# EAGLE schematic ftdiemu (EAGLE 7.2.0)
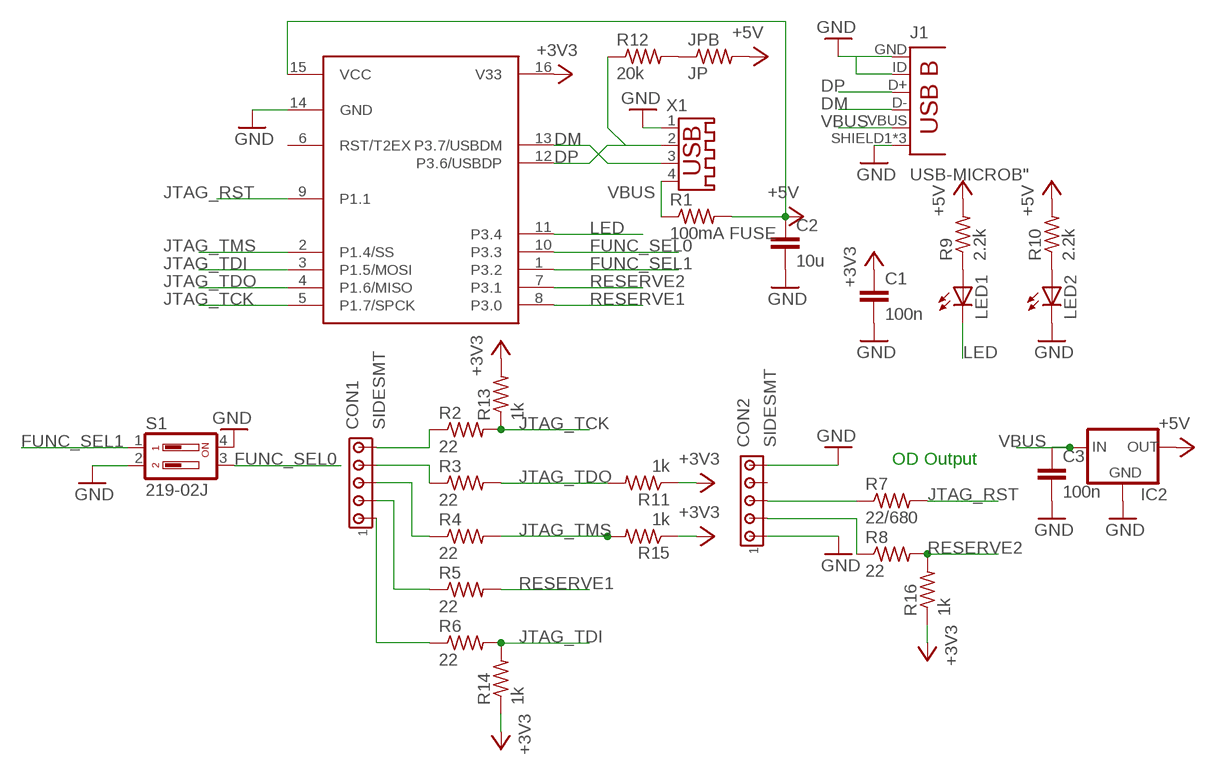
[diagram p0: schematic, sheet 1]

## Parts
C1  100n  C-EUC0805  [C0805]
C2  10u  C-EUC0805  [C0805]
C3  100n  C-EUC0805  [C0805]
CON1  SIDESMT  [SIDESMT]
CON2  SIDESMT  [SIDESMT]
IC1  CH551G-16L  [SO-16]
IC2  XC63FPM  [SOT23]
J1  USB-MICROB"  [USB-B-MICRO-SMD_V03]
JPB  JP  R-US_R0201  [R0201]
LED1  LEDSML0805  [SML0805]
LED2  LEDSML0805  [SML0805]
R1  100mA FUSE  R-US_M0805  [M0805]
R2  22  R-US_R0402  [R0402]
R3  22  R-US_R0402  [R0402]
R4  22  R-US_R0402  [R0402]
R5  22  R-US_R0402  [R0402]
R6  22  R-US_R0402  [R0402]
R7  22/680  R-US_R0402  [R0402]
R8  22  R-US_R0402  [R0402]
R9  2.2k  R-US_M0805  [M0805]
R10  2.2k  R-US_M0805  [M0805]
R11  1k  R-US_R0402  [R0402]
R12  20k  R-US_R0805  [R0805]
R13  1k  R-US_R0402  [R0402]
R14  1k  R-US_R0402  [R0402]
R15  1k  R-US_R0402  [R0402]
R16  1k  R-US_R0402  [R0402]
S1  219-02J  [CTS-219-02J]
X1  USB-A003  [USB-A003]

## Nets
+3V3: C1.1 IC1.16(V33) R11.1 R13.2 R14.1 R15.1 R16.1
+5V: C2.1 IC1.15(VCC) IC2.2(OUT) JPB.2 R1.2 R9.2 R10.2
DM: IC1.13(P3.7/USBDM) J1.D- X1.3
DP: IC1.12(P3.6/USBDP) J1.D+ R12.1 X1.2
FUNC_SEL0: IC1.10(P3.3) S1.3
FUNC_SEL1: IC1.1(P3.2) S1.1
GND: C1.2 C2.2 C3.2 CON2.1 CON2.5 IC1.14(GND) IC2.1(GND) J1.GND J1.ID(USBID) J1.SHIELD1(SHIELD) J1.SHIELD2(SHIELD) J1.SHIELD3(SHIELD) LED2.C S1.2 S1.4 X1.1
JTAG_RST: IC1.9(P1.1) R7.2
JTAG_TCK: IC1.5(P1.7/SPCK) R2.2 R13.1
JTAG_TDI: IC1.3(P1.5/MOSI) R6.2 R14.2
JTAG_TDO: IC1.4(P1.6/MISO) R3.2 R11.2
JTAG_TMS: IC1.2(P1.4/SS) R4.2 R15.2
LED: IC1.11(P3.4) LED1.C
N$3: CON1.5 R2.1
N$5: CON1.4 R3.1
N$6: CON2.3 R7.1
N$7: CON2.2 R8.1
N$8: CON1.3 R4.1
N$9: CON1.2 R5.1
N$10: CON1.1 R6.1
N$11: LED1.A R9.1
N$12: LED2.A R10.1
N$13: JPB.1 R12.2
RESERVE1: IC1.8(P3.0) R5.2
RESERVE2: IC1.7(P3.1) R8.2 R16.2
VBUS: C3.1 IC2.3(IN) J1.VBUS R1.1 X1.4
Unconnected: CON2.4 IC1.6(RST/T2EX)

## Notes on the sheet
- OD Output

## Library data of the parts
C1-C3 = rcl:C-EU: CAPACITOR, European symbol
CON1 CON2 = con-amp:SIDESMT
IC1 = texas:CH551G-16L
IC2 = v-reg:XC63FP: Positiv Voltage Regulators www.torex.co.jp/english/product/pro02/pdf/0201_xc62fp.pdf
J1 = SparkFun-Connectors:USB-MICROB; PROD_ID: CONN-11752
JPB R1-R16 = rcl:R-US_: RESISTOR, American symbol
LED1 LED2 = led:LED: LED OSRAM: - CHIPLED LG R971, LG N971, LY N971, LG Q971, LY Q971, LO R971, LY R971 LH N974, LH R974 LS Q976, LO Q976, LY Q976 LO Q996 - Hyper CHIPLED LW Q18S LB Q993, LB Q99A, LB R99A - SideLED LS A670, LO A670, LY A670, LG A670, LP A670 LB A673, LV A673, LT A673, LW A673 LH A674 LY A675 LS A676, LA A676, LO A676, LY A676, LW A676 LS A679, LY A679, LG A679 - Hyper Micro SIDELED® LS Y876, LA Y876, LO Y876, LY Y876 LT Y87S - SmartLED LW L88C, LW L88S LB L89C, LB L89S, LG L890 LS L89K, LO L89K, LY L89K LS L896, LA L896, LO L896, LY L896 - TOPLED LS T670, LO T670, LY T670, LG T670, LP T670 LSG T670, LSP T670, LSY T670, LOP T670, LYG T670 LG T671, LOG T671, LSG T671 LB T673, LV T673, LT T673, LW T673 LH T674 LS T676, LA T676, LO T676, LY T676, LB T676, LH T676, LSB T676, LW T676 LB T67C, LV T67C, LT T67C, LS T67K, LO T67K, LY T67K, LW E67C LS E67B, LA E67B, LO E67B, LY E67B, LB E67C, LV E67C, LT E67C LW T67C LS T679, LY T679, LG T679 LS T770, LO T770, LY T770, LG T770, LP T770 LB T773, LV T773, LT T773, LW T773 LH T774 LS E675, LA E675, LY E675, LS T675 LS T776, LA T776, LO T776, LY T776, LB T776 LHGB T686 LT T68C, LB T68C - Hyper Mini TOPLED® LB M676 - Mini TOPLED Santana® LG M470 LS M47K, LO M47K, LY M47K Source: http://www.osram.convergy.de LUXEON: - LUMILED® LXK2-PW12-R00, LXK2-PW12-S00, LXK2-PW14-U00, LXK2-PW14-V00 LXK2-PM12-R00, LXK2-PM12-S00, LXK2-PM14-U00 LXK2-PE12-Q00, LXK2-PE12-R00, LXK2-PE12-S00, LXK2-PE14-T00, LXK2-PE14-U00 LXK2-PB12-K00, LXK2-PB12-L00, LXK2-PB12-M00, LXK2-PB14-N00, LXK2-PB14-P00, LXK2-PB14-Q00 LXK2-PR12-L00, LXK2-PR12-M00, LXK2-PR14-Q00, LXK2-PR14-R00 LXK2-PD12-Q00, LXK2-PD12-R00, LXK2-PD12-S00 LXK2-PH12-R00, LXK2-PH12-S00 LXK2-PL12-P00, LXK2-PL12-Q00, LXK2-PL12-R00 Source: www.luxeon.com KINGBRIGHT: KA-3528ASYC Source: www.kingbright.com
S1 = switch-dil:219-02*: Surface Mount DIP Switch Series 219 SMT CTS Electronic Components Sourc: www.ctscorp.com; OC_FARNELL: unknown; OC_NEWARK: unknown
X1 = con-yamaichi:USB-A003: USB connector; OC_FARNELL: unknown; OC_NEWARK: unknown

## Net classes
2 gnd: width 0.305 mm, drill 0.559 mm, clearance 0.254 mm